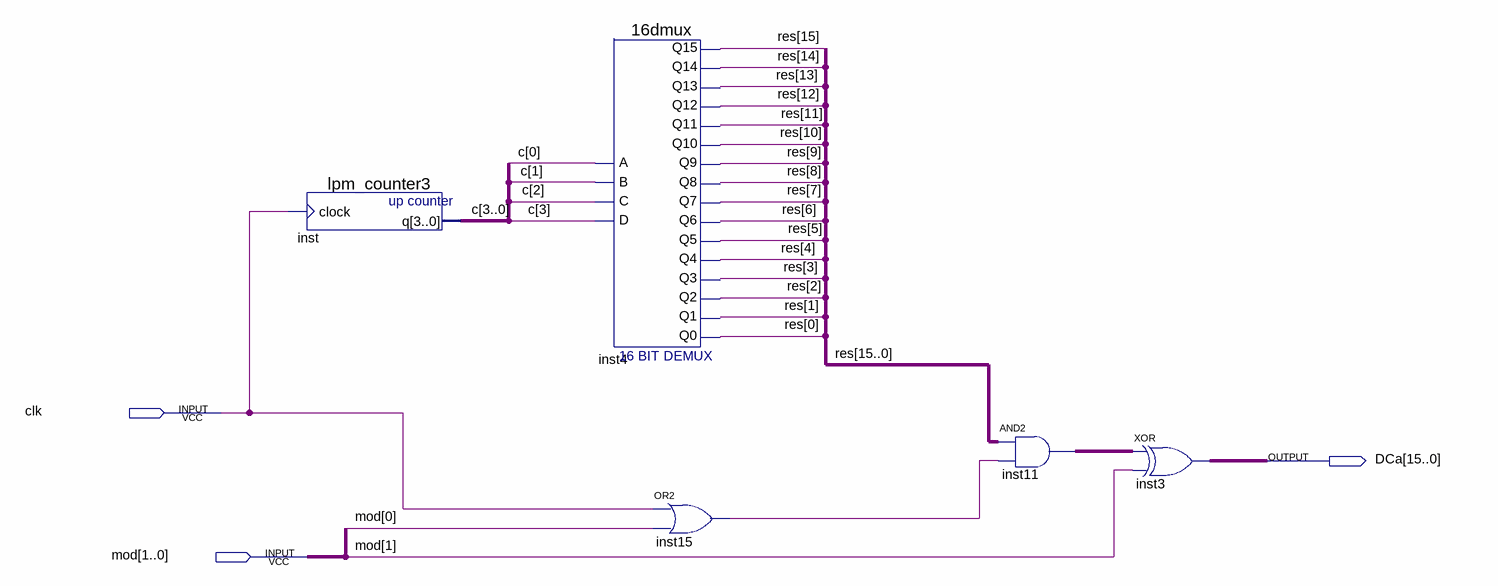
[diagram p0: schematic sheet]
// Quartus schematic CombinedBlocks.bdf as structural Verilog: 5 symbols, 3 pins
module CombinedBlocks (
  input  clk,
  input  [1:0] mod,
  output [15:0] DCa
);

  wire inst15_out;
  wire [3:0] c;
  wire [15:0] inst11_out, res;

  lpm_counter3 inst (.clock(clk), .q(c));
  \16dmux  inst4 (
    .C(c[2]), .B(c[1]), .A(c[0]), .D(c[3]), .Q12(res[12]), .Q13(res[13]), .Q11(res[11]), .Q9(res[9]),
    .Q10(res[10]), .Q7(res[7]), .Q8(res[8]), .Q4(res[4]), .Q5(res[5]), .Q6(res[6]), .Q2(res[2]), .Q3(res[3]),
    .Q14(res[14]), .Q15(res[15]), .Q0(res[0]), .Q1(res[1]));
  or inst15 (inst15_out, clk, mod[0]);
  assign inst11_out = res & {16{inst15_out}};  // AND2 inst11, 16 bits wide
  assign DCa = inst11_out ^ {16{mod[1]}};  // XOR inst3, 16 bits wide
endmodule
